# Altium schematic sheet 52_MIPI_Panel.SchDoc: R01L_F
size A3; DocumentNumber: Kang jin; Revision: 1.0; SheetNumber: 18; SheetTotal: 23
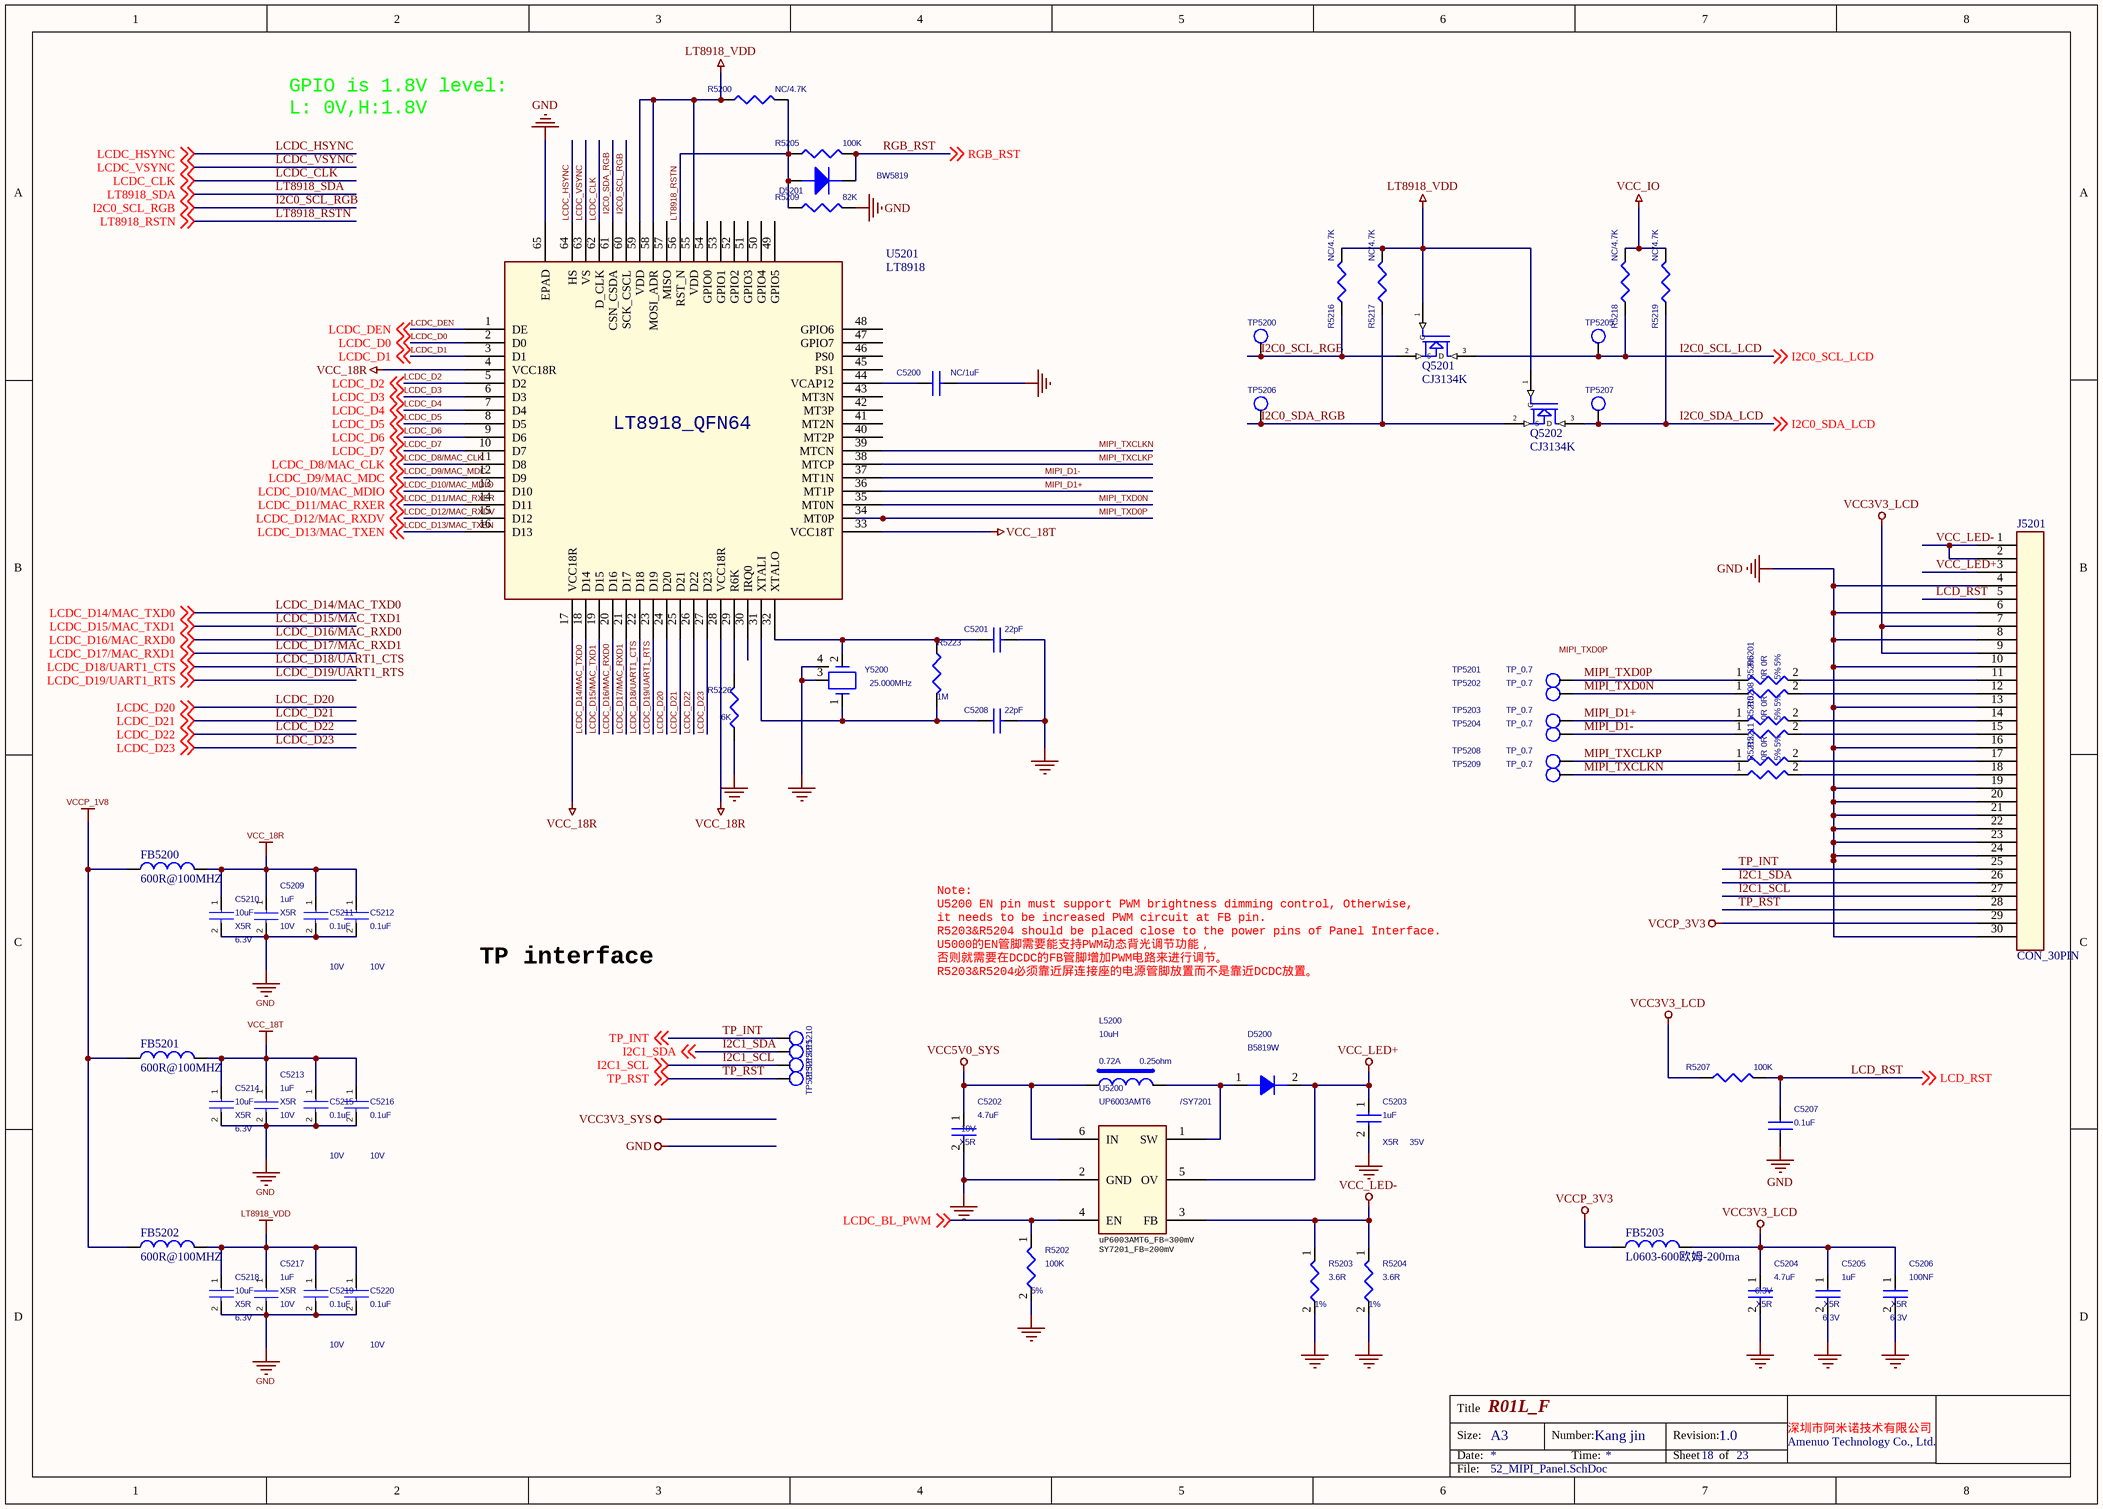
[diagram p0: 52_MIPI_Panel.SchDoc]

## Parts
C5200  NC/1uF  [C0402]
C5201  22pF  [C0402]
C5202  4.7uF  Voltage: 10V  Dielectric: X5R  [C0603]
C5203  1uF  Voltage: 35V  Dielectric: X5R  [C0402]
C5204  4.7uF  Voltage: 6.3V  Dielectric: X5R  [C0402]
C5205  1uF  Voltage: 6.3V  Dielectric: X5R  [C0402]
C5206  100NF  Voltage: 6.3V  Dielectric: X5R  [C0402]
C5207  0.1uF  [C0402]
C5208  22pF  [C0402]
C5209  value 1uF  Voltage: 10V  Dielectric: X5R  [C0402]  (hidden comment: CAP_NP_2)
C5210  value 10uF  Dielectric: X5R  Voltage: 6.3V  [C0603]  (hidden comment: CAP_NP_2)
C5211  value 0.1uF  Voltage: 10V  [C0402]  (hidden comment: CAP_NP_2)
C5212  value 0.1uF  Voltage: 10V  [C0402]  (hidden comment: CAP_NP_2)
C5213  value 1uF  Voltage: 10V  Dielectric: X5R  [C0402]  (hidden comment: CAP_NP_2)
C5214  value 10uF  Dielectric: X5R  Voltage: 6.3V  [C0603]  (hidden comment: CAP_NP_2)
C5215  value 0.1uF  Voltage: 10V  [C0402]  (hidden comment: CAP_NP_2)
C5216  value 0.1uF  Voltage: 10V  [C0402]  (hidden comment: CAP_NP_2)
C5217  value 1uF  Voltage: 10V  Dielectric: X5R  [C0402]  (hidden comment: CAP_NP_2)
C5218  value 10uF  Dielectric: X5R  Voltage: 6.3V  [C0603]  (hidden comment: CAP_NP_2)
C5219  value 0.1uF  Voltage: 10V  [C0402]  (hidden comment: CAP_NP_2)
C5220  value 0.1uF  Voltage: 10V  [C0402]  (hidden comment: CAP_NP_2)
D5200  B5819W  [SOD123]
D5201  BW5819  [SOD-323]
FB5200  600R@100MHZ  [L0402]
FB5201  600R@100MHZ  [L0402]
FB5202  600R@100MHZ  [L0402]
FB5203  L0603-600欧姆-200ma  [L0402]
J5201  CON_30PIN  [X05A10H30G]
L5200  10uH  DC Resistor: 0.25ohm  Isat: 0.72A  [IND-3X3]
Q5201  CJ3134K  [SOT23]
Q5202  CJ3134K  [SOT23]
R5200  NC/4.7K  [R0402]
R5201  0R  Tolerance: 5%  [R0402]
R5202  100K  Tolerance: 5%  [R0402]
R5203  3.6R  Tolerance: 1%  [R0402]
R5204  3.6R  Tolerance: 1%  [R0402]
R5205  100K  [R0402]
R5206  0R  Tolerance: 5%  [R0402]
R5207  100K  [R0402]
R5208  0R  Tolerance: 5%  [R0402]
R5209  82K  [R0402]
R5210  0R  Tolerance: 5%  [R0402]
R5211  0R  Tolerance: 5%  [R0402]
R5212  0R  Tolerance: 5%  [R0402]
R5216  NC/4.7K  [R0402]
R5217  NC/4.7K  [R0402]
R5218  NC/4.7K  [R0402]
R5219  NC/4.7K  [R0402]
R5223  1M  [R0402]
R5226  6K  [R0402]
TP5200  TP_0.7  [TEST]  (value not drawn)
TP5201  TP_0.7  [TP]
TP5202  TP_0.7  [TP]
TP5203  TP_0.7  [TP]
TP5204  TP_0.7  [TP]
TP5205  TP_0.7  [TEST]  (value not drawn)
TP5206  TP_0.7  [TEST]  (value not drawn)
TP5207  TP_0.7  [TEST]  (value not drawn)
TP5208  TP_0.7  [TP]
TP5209  TP_0.7  [TP]
TP5210  TP_0.7  [TEST]  (value not drawn)
TP5211  TP_0.7  [TEST]  (value not drawn)
TP5212  TP_0.7  [TEST]  (value not drawn)
TP5213  TP_0.7  [TEST]  (value not drawn)
U5200  UP6003AMT6  Option: /SY7201  [SOT-23-6]
U5201  LT8918  [LT8918_QFN64_EPAD]
Y5200  25.000MHz  [SMD_3225]

## Nets
GND: C5200.2 C5201.2 C5202.2 C5203.2 C5204.2 C5205.2 C5206.2 C5207.2 C5208.2 C5209.2 C5210.2 C5211.2 C5212.2 C5213.2 C5214.2 C5215.2 C5216.2 C5217.2 C5218.2 C5219.2 C5220.2 J5201.4 J5201.6 J5201.8 J5201.10 J5201.13 J5201.16 J5201.19 J5201.20 J5201.21 J5201.22 J5201.23 J5201.24 J5201.30 R5202.2 R5203.2 R5204.2 R5209.2 R5226.1 U5200.2(GND) U5201.65(EPAD) Y5200.3 Y5200.4
LT8918_VDD: C5217.1 C5218.1 C5219.1 C5220.1 FB5202.2 Q5201.1(G) Q5202.1(G) R5200.1 R5216.2 R5217.2 U5201.55(VDD) U5201.58(MOSI_ADR) U5201.59(VDD)
VCC3V3_LCD: C5204.1 C5205.1 C5206.1 FB5203.2 J5201.7 J5201.9 R5207.1
VCC5V0_SYS: C5202.1 L5200.1 U5200.6(IN)
VCC_18R: C5209.1 C5210.1 C5211.1 C5212.1 FB5200.2 U5201.4(VCC18R) U5201.17(VCC18R) U5201.28(VCC18R)
VCC_18T: C5213.1 C5214.1 C5215.1 C5216.1 FB5201.2 U5201.33(VCC18T)
VCC_IO: R5218.2 R5219.2
VCC_LED+: C5203.1 D5200.2(K) J5201.3 U5200.5(OV)
VCC_LED-: J5201.1 J5201.2 R5203.1 R5204.1 U5200.3(FB)
VCCP_1V8: FB5200.1 FB5201.1 FB5202.1
VCCP_3V3: FB5203.1 J5201.29
I2C0_SCL_LCD: Q5201.3(D) R5218.1 TP5205.1 ; off-sheet I2C0_SCL_LCD
I2C0_SCL_RGB: Q5201.2(S) R5216.1 TP5200.1 U5201.60(SCK_CSCL) ; off-sheet I2C0_SCL_RGB
I2C0_SDA_LCD: Q5202.3(D) R5219.1 TP5207.1 ; off-sheet I2C0_SDA_LCD
I2C0_SDA_RGB: Q5202.2(S) R5217.1 TP5206.1 U5201.61(CSN_CSDA)
I2C1_SCL: J5201.27 TP5212.1 ; off-sheet I2C1_SCL
I2C1_SDA: J5201.26 TP5211.1 ; off-sheet I2C1_SDA
LCD_RST: C5207.1 J5201.5 R5207.2 ; off-sheet LCD_RST
LCDC_BL_PWM: R5202.1 U5200.4(EN) ; off-sheet LCDC_BL_PWM
LCDC_CLK: U5201.62(D_CLK) ; off-sheet LCDC_CLK
LCDC_D0: U5201.2(D0) ; off-sheet LCDC_D0
LCDC_D1: U5201.3(D1) ; off-sheet LCDC_D1
LCDC_D2: U5201.5(D2) ; off-sheet LCDC_D2
LCDC_D3: U5201.6(D3) ; off-sheet LCDC_D3
LCDC_D4: U5201.7(D4) ; off-sheet LCDC_D4
LCDC_D5: U5201.8(D5) ; off-sheet LCDC_D5
LCDC_D6: U5201.9(D6) ; off-sheet LCDC_D6
LCDC_D7: U5201.10(D7) ; off-sheet LCDC_D7
LCDC_D8/MAC_CLK: U5201.11(D8) ; off-sheet LCDC_D8/MAC_CLK
LCDC_D9/MAC_MDC: U5201.12(D9) ; off-sheet LCDC_D9/MAC_MDC
LCDC_D10/MAC_MDIO: U5201.13(D10) ; off-sheet LCDC_D10/MAC_MDIO
LCDC_D11/MAC_RXER: U5201.14(D11) ; off-sheet LCDC_D11/MAC_RXER
LCDC_D12/MAC_RXDV: U5201.15(D12) ; off-sheet LCDC_D12/MAC_RXDV
LCDC_D13/MAC_TXEN: U5201.16(D13) ; off-sheet LCDC_D13/MAC_TXEN
LCDC_D14/MAC_TXD0: U5201.18(D14) ; off-sheet LCDC_D14/MAC_TXD0
LCDC_D15/MAC_TXD1: U5201.19(D15) ; off-sheet LCDC_D15/MAC_TXD1
LCDC_D16/MAC_RXD0: U5201.20(D16) ; off-sheet LCDC_D16/MAC_RXD0
LCDC_D17/MAC_RXD1: U5201.21(D17) ; off-sheet LCDC_D17/MAC_RXD1
LCDC_D18/UART1_CTS: U5201.22(D18) ; off-sheet LCDC_D18/UART1_CTS
LCDC_D19/UART1_RTS: U5201.23(D19) ; off-sheet LCDC_D19/UART1_RTS
LCDC_D20: U5201.24(D20) ; off-sheet LCDC_D20
LCDC_D21: U5201.25(D21) ; off-sheet LCDC_D21
LCDC_D22: U5201.26(D22) ; off-sheet LCDC_D22
LCDC_D23: U5201.27(D23) ; off-sheet LCDC_D23
LCDC_DEN: U5201.1(DE) ; off-sheet LCDC_DEN
LCDC_HSYNC: U5201.64(HS) ; off-sheet LCDC_HSYNC
LCDC_VSYNC: U5201.63(VS) ; off-sheet LCDC_VSYNC
LT8918_RSTN: D5201.1(+) R5200.2 R5205.1 R5209.1 U5201.56(RST_N) ; off-sheet LT8918_RSTN
MIPI_D1+: R5208.1 TP5203.1 U5201.36(MT1P)
MIPI_D1-: R5210.1 TP5204.1 U5201.37(MT1N)
MIPI_TXCLKN: R5212.1 TP5209.1 U5201.39(MTCN)
MIPI_TXCLKP: R5211.1 TP5208.1 U5201.38(MTCP)
MIPI_TXD0N: R5206.1 TP5202.1 U5201.35(MT0N)
MIPI_TXD0P: R5201.1 TP5201.1 U5201.34(MT0P)
RGB_RST: D5201.2(-) R5205.2 ; off-sheet RGB_RST
TP_INT: J5201.25 TP5210.1 ; off-sheet TP_INT
TP_RST: J5201.28 TP5213.1 ; off-sheet TP_RST
NetC5200_1: C5200.1 U5201.44(VCAP12)
NetC5201_1: C5201.1 R5223.1 U5201.32(XTALO) Y5200.2
NetC5208_1: C5208.1 R5223.2 U5201.31(XTALI) Y5200.1
NetD5200_1: D5200.1(A) L5200.2 U5200.1(SW)
NetJ5201_11: J5201.11 R5201.2
NetJ5201_12: J5201.12 R5206.2
NetJ5201_14: J5201.14 R5208.2
NetJ5201_15: J5201.15 R5210.2
NetJ5201_17: J5201.17 R5211.2
NetJ5201_18: J5201.18 R5212.2
NetR5226_2: R5226.2 U5201.29(R6K)

Not connected (* = marked no-connect by the designer): U5201 30(IRQ0) 40(MT2P) 41(MT2N) 42(MT3P) 43(MT3N) 45(PS1) 46(PS0) 47(GPIO7) 48(GPIO6) 49(GPIO5) 50(GPIO4) 51(GPIO3) 52(GPIO2) 53(GPIO1) 54(GPIO0) 57(MISO)

## Notes on the sheet
- GPIO is 1.8V level:
  L: 0V,H:1.8V
- TP interface
- Note:
  U5200 EN pin must support PWM brightness dimming control, Otherwise,
  it needs to be increased PWM circuit at FB pin.
  R5203&R5204 should be placed close to the power pins of Panel Interface.
  U5000的EN管脚需要能支持PWM动态背光调节功能，
  否则就需要在DCDC的FB管脚增加PWM电路来进行调节。
  R5203&R5204必须靠近屏连接座的电源管脚放置而不是靠近DCDC放置。
- (near U5200) uP6003AMT6_FB=300mV
  SY7201_FB=200mV
- Labels drawn without touching a wire or pin: MIPI_TXD0P
- Title
- Size:
- Date:
- A3
- Number:
- Time:
- Revision:
- Sheet
- of
- 深圳市阿米诺技术有限公司
- Amenuo Technology Co., Ltd.
- File:
- (in symbol LT8918) LT8918_QFN64

## Library data of the parts
C5200 = CAP_NP0603: Designer: Hujin; Create Date: 20130122; Part Type: CAPACITOR; Part Number: 117-00-3040
C5201 C5208 = CAP_NP0603_Dup1: Designer: Hujin; Create Date: 20130122; Part Number: 117-00-3002
C5202 = CAP NP_Dup1: cap,4.70uF,+/-10%,10V,X5R,C0603; Manufacturer PN: C1608X5R1A475K080AC; Manufacturer: TDK; Tolerance: 10%; Priority: A; Created by: JJJ; Part Type: C0603; RK PN: C1608X5R1A475K080AC
C5203 = CAP NP_Dup1: cap,1.00uF,+/-10%,35V,X5R,C0402; Manufacturer PN: C1005X5R1V105K050BC; Manufacturer: TDK; Tolerance: 10%; Priority: A; Created by: JJJ; Part Type: C0402; RK PN: C1005X5R1V105K050BC
C5204 = CAP NP_Dup1: cap,4.70uF,+/-10%,6.3V,X5R,C0402; Manufacturer: TDK; RK PN: C1005X5R0J475K050BC; Priority: A; Tolerance: 10%; Part Type: C0402; Manufacturer PN: C1005X5R0J475K050BC; Created by: JJJ
C5205 = CAP NP_Dup1: cap,1.00uF,+/-10%,6.3V,X5R,C0402; Manufacturer PN: C1005X5R0J105K050BB; Manufacturer: TDK; Tolerance: 10%; Priority: A; Created by: JJJ; Part Type: C0402; RK PN: C1005X5R0J105K050BB
C5206 = CAP NP_Dup1: cap,100.00nF,+/-10%,6.3V,X5R,C0402; Manufacturer PN: C1005X5R0J104K050BA; Manufacturer: TDK; Tolerance: 10%; Priority: A; Created by: JJJ; Part Type: C0402; RK PN: C1005X5R0J104K050BA
C5207 = CAP NP_Dup1: 贴片电容
C5209 C5213 C5217 = CAP_NP_2: cap,1.00uF,+/-10%,10V,X5R,C0402; Manufacturer_PN: C1005X5R1A105K050BB; Manufacturer: TDK; Created_by: JJJ; Tolerance: 10%; C_Voltage: 6.3V; Priority: A; Source_Path: Z:\RK_STANDARD_LIBRARY\CADENCE_CIS\RK_DISCRETE.OLB; PCB DECAL: C0402; Part_Type: C0402; RK_PN: C1005X5R1A105K050BB
C5210 C5214 C5218 = CAP_NP_2: cap,10.00uF,+/-10%,6.3V,X5R,C0603; Manufacturer: TDK; RK_PN: C1608X5R0J106K080AB; Priority: A; Tolerance: 10%; Created_by: JJJ; Source_Path: Z:\RK_STANDARD_LIBRARY\CADENCE_CIS\RK_DISCRETE.OLB; Number: 1; PCB DECAL: C0603; Part_Type: C0603; Manufacturer_PN: C1608X5R0J106K080AB
C5211 C5212 C5215 C5216 C5219 C5220 = CAP_NP_2: cap,0.1uF,+/-10%,10V,X5R,C0402; Manufacturer: TDK; RK_PN: C1005X5R1A105K050BB; Priority: A; C_Voltage: 6.3V; Tolerance: 10%; Created_by: JJJ; Source_Path: Z:\RK_STANDARD_LIBRARY\CADENCE_CIS\RK_DISCRETE.OLB; Part_Type: C0402; Dielectric: X5R; Manufacturer_PN: C1005X5R1A105K050BB; PCB DECAL: C0402
D5200 = DIODE_Dup1: Schottky Barrier，B5819W SOD-123; Manufacturer: 长电; Priority: A; RK PN: B5819W; Part Type: Schottky rectifier; Manufacturer PN: B5819W; Created by: JJJ
D5201 = DIODE: Diode DO-214AA SMA; Manufacturer: Diodes; Manufacturer Part Number: B220/A; Part Number: TY01100606; PN: ss34; Vendor: Rohm; Part Type: Diode
FB5200-FB5202 = INDUCTOR: 磁珠;600R@100MHZ;0.34R;0.45A;0402;贴片;
FB5203 = INDUCTOR: L0603-0欧姆-1A
L5200 = INDUCTORS OF FERRITE: Power Inductor,10uH,0.2,IND_303015; Manufacturer PN: SWPA3015S100MT; Manufacturer: sunlord; Resonace frequency: 41M; Irms: 0.77A; Tolerance: 20%; Priority: A; Created by: YTL; Part Type: POWER_IND; RK PN: SWPA3015S100MT
Q5201 Q5202 = MOSFET-2S3D
R5200 R5205 R5207 R5209 R5216-R5219 = RESISTOR_1: 贴片电阻; ROOM: USB+5V; MARK: 51K
R5201 R5206 R5208 R5210-R5212 = RESISTOR_Dup1: 通用厚膜电阻,0R,+/-5%,R0402,1/16W.; Manufacturer PN: RC0402JR-0727KL; Manufacturer: YAGEO; Wattage: 1/16W; Priority: A; RK PN: RC0402JR-0R; Created by: YTL; Part Type: 通用厚膜电阻
R5202 = RESISTOR_Dup1: 通用厚膜电阻,100K,+/-5%,R0402,1/16W.; Manufacturer PN: RC0402JR-07100KL; Manufacturer: YAGEO; Wattage: 1/16W; Priority: A; Created by: YTL; Part Type: 通用厚膜电阻; RK PN: RC0402JR-07100KL
R5203 = RESISTOR_Dup1: 通用厚膜电阻,3R6,+/-1%,R0603,1/10W.; Manufacturer: YAGEO; RK PN: RC0603FR-073R6L; Priority: A; Wattage: 1/10W; Part Type: 通用厚膜电阻; Manufacturer PN: RC0603FR-073R6L; Created by: YTL
R5204 = RESISTOR_Dup1: 通用厚膜电阻,3R6,+/-1%,R0603,1/10W.; Manufacturer PN: RC0603FR-073R6L; Manufacturer: YAGEO; Wattage: 1/10W; Priority: A; Created by: YTL; Part Type: 通用厚膜电阻; RK PN: RC0603FR-073R6L
R5223 = RES0603_Dup3: Designer: Hujin; Create Date: 20130124; Part Number: 737-00-3074
R5226 = RES0603_Dup2: Designer: Hujin; Purchase Information: 13510796878 伊美尔电子; Standard PCB Footprint: 0603; PCB Footprint Status: Checked; Tolerance: %5; Create Date: 20130124; Part Status: On Hand; Price: 0.0028; Part Type: RESISTOR; Part Number: 737-00-3049
TP5200 TP5205-TP5207 TP5210-TP5213 = TP: Test Point 0.7mm; RK PN: TESTPOINT_0R7; Priority: A; Part Type: TP; Created by: JJJ
TP5201-TP5204 TP5208 TP5209 = TP: Priority: A; RK PN: TESTPOINT_0R7; Created by: JJJ; Part Type: TP
U5200 = DCDC_MP1488: Tiny Package, High Performance, Constant Current Switching Regulator for 10X White LED; Manufacturer: UPI(力智电子); Priority: A; Created by: JJJ; Manufacturer PN: UP6003AMT6; Part Type: DCDC; RK PN: UP6003AMT6
Y5200 = CRYSTAL_0: pin to pad: 2>3 3>2